# EAGLE schematic rev4.0 (EAGLE 7.5.0)

## Sheet 1 of 3
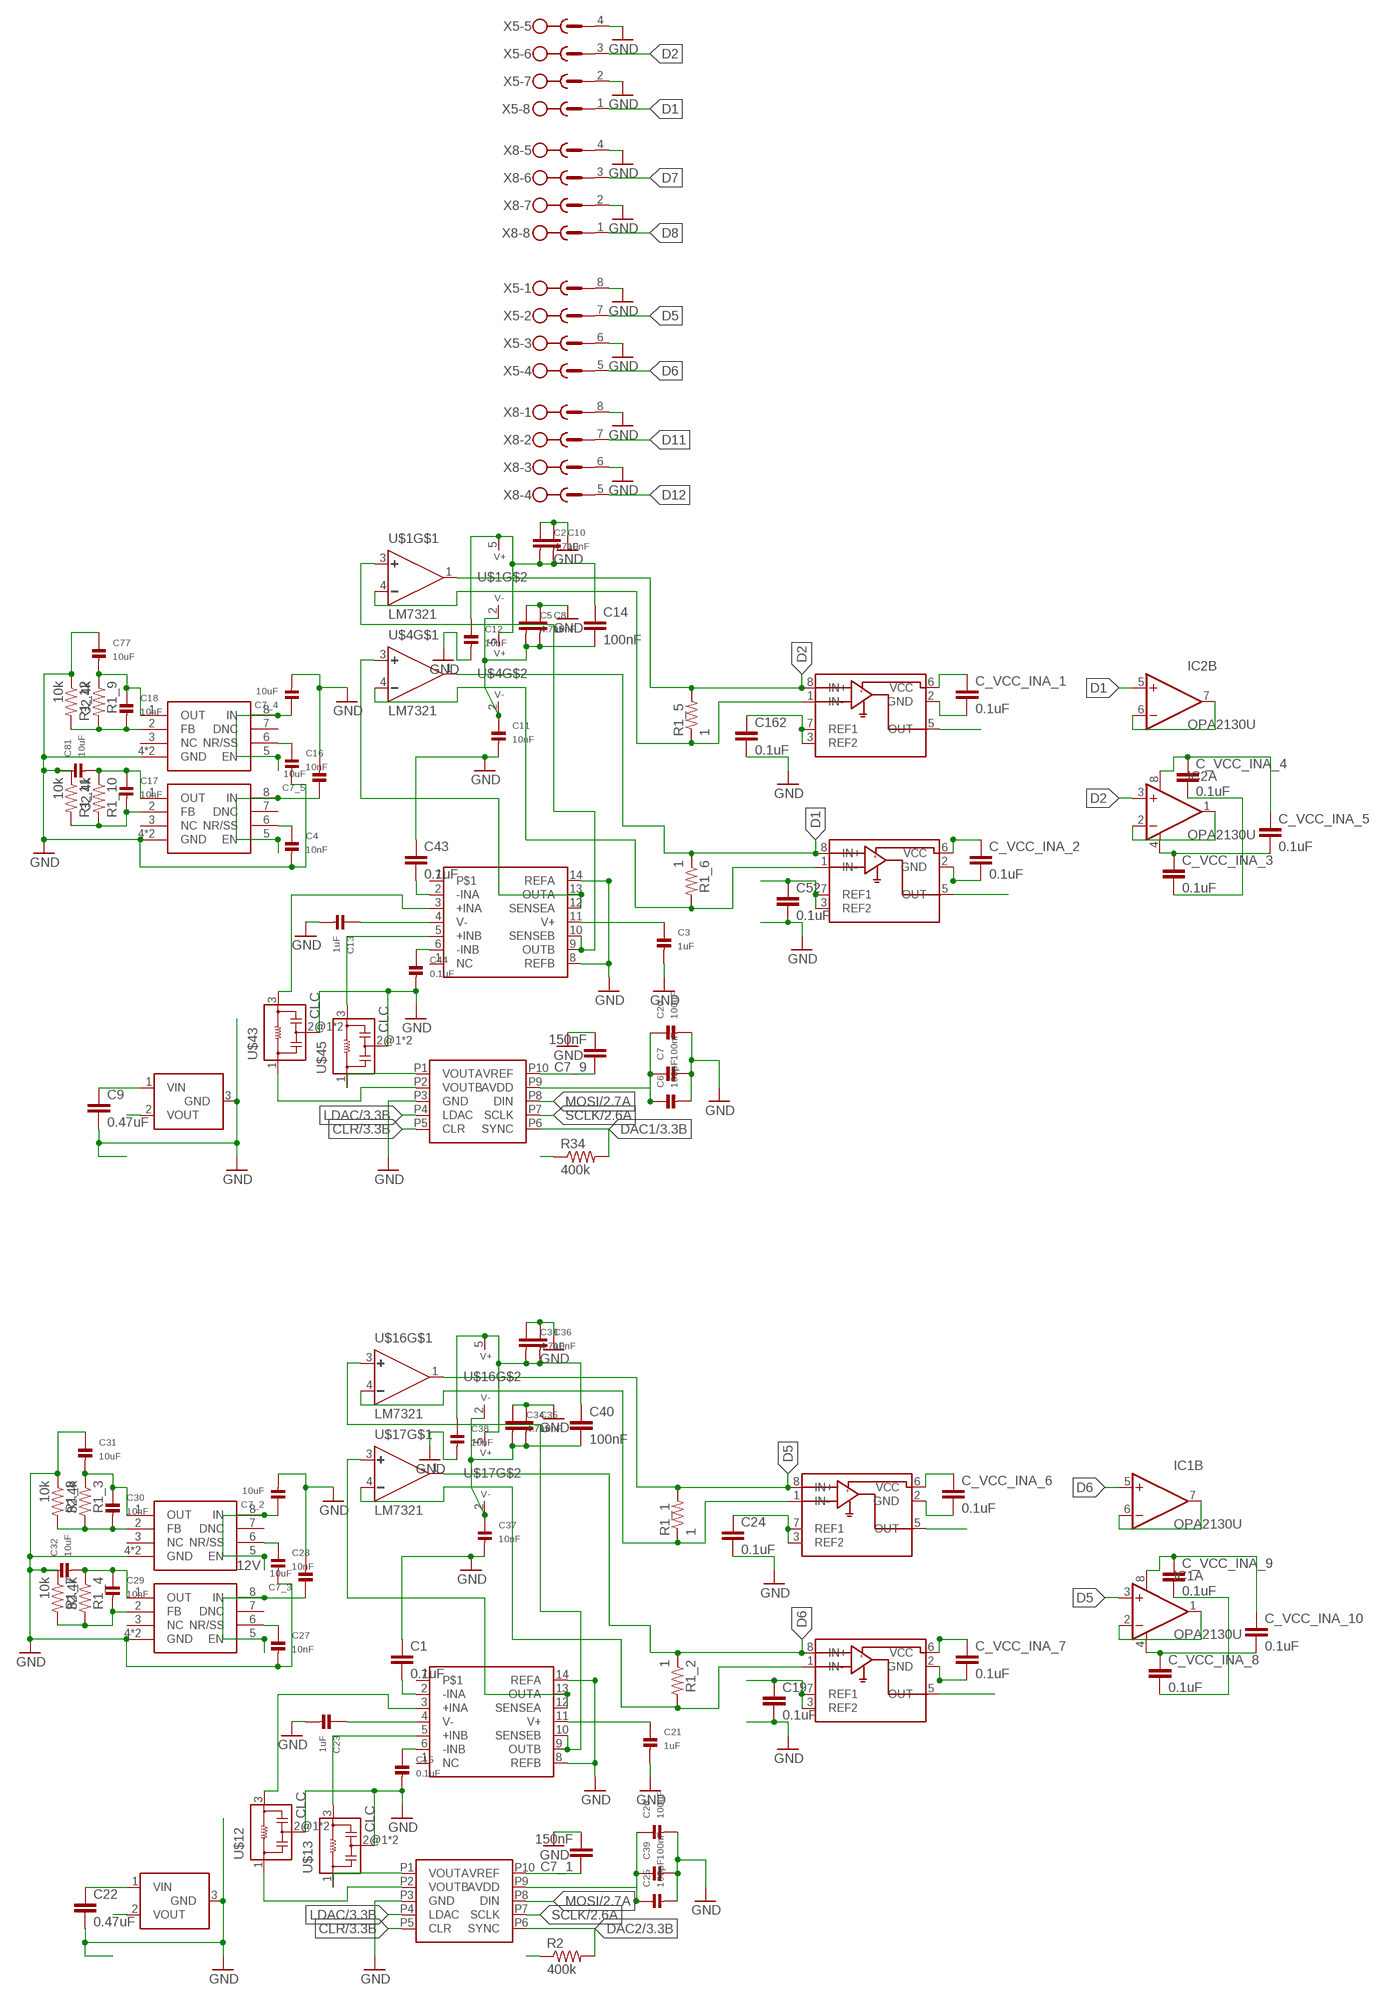
[diagram p0: schematic, sheet 1, part 1 of 2]
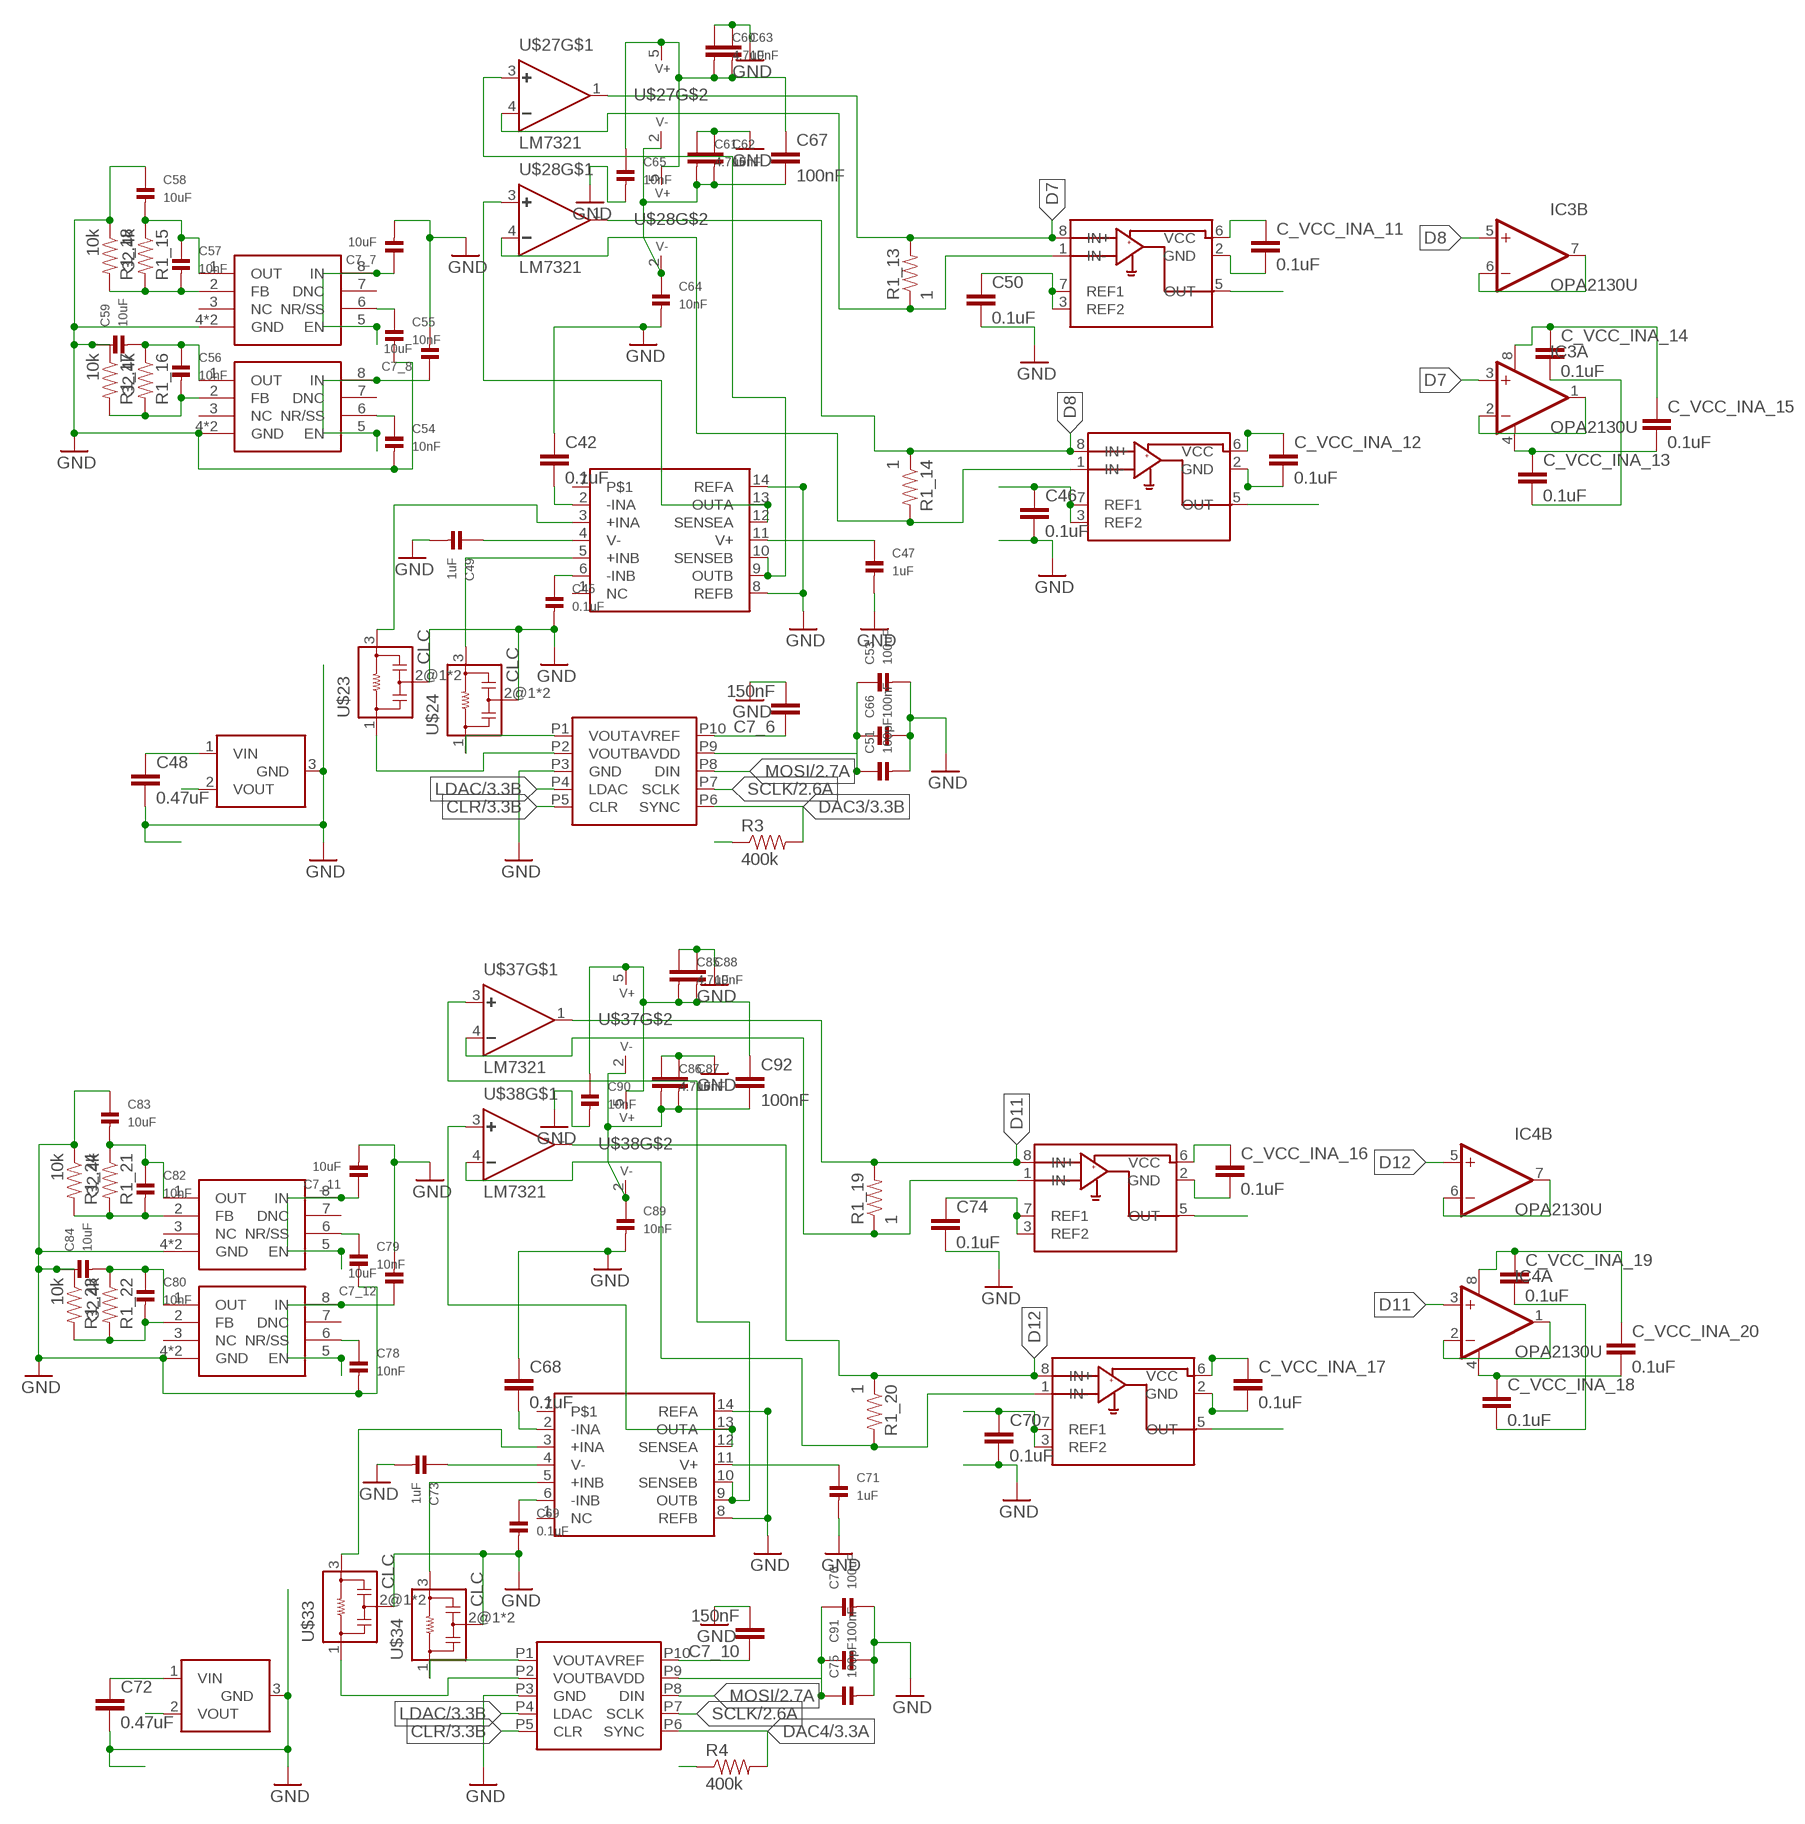
[diagram p1: schematic, sheet 1, part 2 of 2]

### Parts
C1  0.1uF  CAP0402-CAP  [0402-CAP]
C2  4.7uF  CAP_CERAMIC0805  [0805]
C3  1uF  CAP_CERAMIC0402  [0402]
C4  10nF  CAP_CERAMIC0402  [0402]
C5  4.7uF  CAP_CERAMIC0805  [0805]
C6  100pF  CAP_CERAMIC0402  [0402]
C7  100nF  CAP_CERAMIC0402  [0402]
C7_1  150nF  CAP0402-CAP  [0402-CAP]
C7_2  10uF  CAP_CERAMIC0805  [0805]
C7_3  10uF  CAP_CERAMIC0805  [0805]
C7_4  10uF  CAP_CERAMIC0805  [0805]
C7_5  10uF  CAP_CERAMIC0805  [0805]
C7_6  150nF  CAP0402-CAP  [0402-CAP]
C7_7  10uF  CAP_CERAMIC0805  [0805]
C7_8  10uF  CAP_CERAMIC0805  [0805]
C7_9  150nF  CAP0402-CAP  [0402-CAP]
C7_10  150nF  CAP0402-CAP  [0402-CAP]
C7_11  10uF  CAP_CERAMIC0805  [0805]
C7_12  10uF  CAP_CERAMIC0805  [0805]
C8  10nF  CAP_CERAMIC0402  [0402]
C9  0.47uF  CAP0402-CAP  [0402-CAP]
C10  10nF  CAP_CERAMIC0402  [0402]
C11  10nF  CAP_CERAMIC0402  [0402]
C12  10nF  CAP_CERAMIC0402  [0402]
C13  1uF  CAP_CERAMIC0402  [0402]
C14  100nF  CAP0402-CAP  [0402-CAP]
C15  0.1uF  CAP_CERAMIC0402  [0402]
C16  10nF  CAP_CERAMIC0402  [0402]
C17  10nF  CAP_CERAMIC0402  [0402]
C18  10nF  CAP_CERAMIC0402  [0402]
C19  0.1uF  CAP0402-CAP  [0402-CAP]
C20  100uF  CAP_CERAMIC1206  [1206]
C21  1uF  CAP_CERAMIC0402  [0402]
C22  0.47uF  CAP0402-CAP  [0402-CAP]
C23  1uF  CAP_CERAMIC0402  [0402]
C24  0.1uF  CAP0402-CAP  [0402-CAP]
C25  100pF  CAP_CERAMIC0402  [0402]
C26  100uF  CAP_CERAMIC1206  [1206]
C27  10nF  CAP_CERAMIC0402  [0402]
C28  10nF  CAP_CERAMIC0402  [0402]
C29  10nF  CAP_CERAMIC0402  [0402]
C30  10nF  CAP_CERAMIC0402  [0402]
C31  10uF  CAP_CERAMIC0805  [0805]
C32  10uF  CAP_CERAMIC0805  [0805]
C33  4.7uF  CAP_CERAMIC0805  [0805]
C34  4.7uF  CAP_CERAMIC0805  [0805]
C35  10nF  CAP_CERAMIC0402  [0402]
C36  10nF  CAP_CERAMIC0402  [0402]
C37  10nF  CAP_CERAMIC0402  [0402]
C38  10nF  CAP_CERAMIC0402  [0402]
C39  100nF  CAP_CERAMIC0402  [0402]
C40  100nF  CAP0402-CAP  [0402-CAP]
C42  0.1uF  CAP0402-CAP  [0402-CAP]
C43  0.1uF  CAP0402-CAP  [0402-CAP]
C44  0.1uF  CAP_CERAMIC0402  [0402]
C45  0.1uF  CAP_CERAMIC0402  [0402]
C46  0.1uF  CAP0402-CAP  [0402-CAP]
C47  1uF  CAP_CERAMIC0402  [0402]
C48  0.47uF  CAP0402-CAP  [0402-CAP]
C49  1uF  CAP_CERAMIC0402  [0402]
C50  0.1uF  CAP0402-CAP  [0402-CAP]
C51  100pF  CAP_CERAMIC0402  [0402]
C52  0.1uF  CAP0402-CAP  [0402-CAP]
C53  100uF  CAP_CERAMIC1206  [1206]
C54  10nF  CAP_CERAMIC0402  [0402]
C55  10nF  CAP_CERAMIC0402  [0402]
C56  10nF  CAP_CERAMIC0402  [0402]
C57  10nF  CAP_CERAMIC0402  [0402]
C58  10uF  CAP_CERAMIC0805  [0805]
C59  10uF  CAP_CERAMIC0805  [0805]
C60  4.7uF  CAP_CERAMIC0805  [0805]
C61  4.7uF  CAP_CERAMIC0805  [0805]
C62  10nF  CAP_CERAMIC0402  [0402]
C63  10nF  CAP_CERAMIC0402  [0402]
C64  10nF  CAP_CERAMIC0402  [0402]
C65  10nF  CAP_CERAMIC0402  [0402]
C66  100nF  CAP_CERAMIC0402  [0402]
C67  100nF  CAP0402-CAP  [0402-CAP]
C68  0.1uF  CAP0402-CAP  [0402-CAP]
C69  0.1uF  CAP_CERAMIC0402  [0402]
C70  0.1uF  CAP0402-CAP  [0402-CAP]
C71  1uF  CAP_CERAMIC0402  [0402]
C72  0.47uF  CAP0402-CAP  [0402-CAP]
C73  1uF  CAP_CERAMIC0402  [0402]
C74  0.1uF  CAP0402-CAP  [0402-CAP]
C75  100pF  CAP_CERAMIC0402  [0402]
C76  100uF  CAP_CERAMIC1206  [1206]
C77  10uF  CAP_CERAMIC0805  [0805]
C78  10nF  CAP_CERAMIC0402  [0402]
C79  10nF  CAP_CERAMIC0402  [0402]
C80  10nF  CAP_CERAMIC0402  [0402]
C81  10uF  CAP_CERAMIC0805  [0805]
C82  10nF  CAP_CERAMIC0402  [0402]
C83  10uF  CAP_CERAMIC0805  [0805]
C84  10uF  CAP_CERAMIC0805  [0805]
C85  4.7uF  CAP_CERAMIC0805  [0805]
C86  4.7uF  CAP_CERAMIC0805  [0805]
C87  10nF  CAP_CERAMIC0402  [0402]
C88  10nF  CAP_CERAMIC0402  [0402]
C89  10nF  CAP_CERAMIC0402  [0402]
C90  10nF  CAP_CERAMIC0402  [0402]
C91  100nF  CAP_CERAMIC0402  [0402]
C92  100nF  CAP0402-CAP  [0402-CAP]
C162  0.1uF  CAP0402-CAP  [0402-CAP]
C_VCC_INA_1  0.1uF  CAP0402-CAP  [0402-CAP]
C_VCC_INA_2  0.1uF  CAP0402-CAP  [0402-CAP]
C_VCC_INA_3  0.1uF  CAP0402-CAP  [0402-CAP]
C_VCC_INA_4  0.1uF  CAP0402-CAP  [0402-CAP]
C_VCC_INA_5  0.1uF  CAP0402-CAP  [0402-CAP]
C_VCC_INA_6  0.1uF  CAP0402-CAP  [0402-CAP]
C_VCC_INA_7  0.1uF  CAP0402-CAP  [0402-CAP]
C_VCC_INA_8  0.1uF  CAP0402-CAP  [0402-CAP]
C_VCC_INA_9  0.1uF  CAP0402-CAP  [0402-CAP]
C_VCC_INA_10  0.1uF  CAP0402-CAP  [0402-CAP]
C_VCC_INA_11  0.1uF  CAP0402-CAP  [0402-CAP]
C_VCC_INA_12  0.1uF  CAP0402-CAP  [0402-CAP]
C_VCC_INA_13  0.1uF  CAP0402-CAP  [0402-CAP]
C_VCC_INA_14  0.1uF  CAP0402-CAP  [0402-CAP]
C_VCC_INA_15  0.1uF  CAP0402-CAP  [0402-CAP]
C_VCC_INA_16  0.1uF  CAP0402-CAP  [0402-CAP]
C_VCC_INA_17  0.1uF  CAP0402-CAP  [0402-CAP]
C_VCC_INA_18  0.1uF  CAP0402-CAP  [0402-CAP]
C_VCC_INA_19  0.1uF  CAP0402-CAP  [0402-CAP]
C_VCC_INA_20  0.1uF  CAP0402-CAP  [0402-CAP]
IC1  OPA2130U  [SO08]
IC2  OPA2130U  [SO08]
IC3  OPA2130U  [SO08]
IC4  OPA2130U  [SO08]
R1_1  1  RESISTOR0603-RES  [0603-RES]
R1_2  1  RESISTOR0603-RES  [0603-RES]
R1_3  32.4k  RESISTOR0603-RES  [0603-RES]
R1_4  32.4k  RESISTOR0603-RES  [0603-RES]
R1_5  1  RESISTOR0603-RES  [0603-RES]
R1_6  1  RESISTOR0603-RES  [0603-RES]
R1_7  10k  RESISTOR0603-RES  [0603-RES]
R1_8  10k  RESISTOR0603-RES  [0603-RES]
R1_9  32.4k  RESISTOR0603-RES  [0603-RES]
R1_10  32.4k  RESISTOR0603-RES  [0603-RES]
R1_11  10k  RESISTOR0603-RES  [0603-RES]
R1_12  10k  RESISTOR0603-RES  [0603-RES]
R1_13  1  RESISTOR0603-RES  [0603-RES]
R1_14  1  RESISTOR0603-RES  [0603-RES]
R1_15  32.4k  RESISTOR0603-RES  [0603-RES]
R1_16  32.4k  RESISTOR0603-RES  [0603-RES]
R1_17  10k  RESISTOR0603-RES  [0603-RES]
R1_18  10k  RESISTOR0603-RES  [0603-RES]
R1_19  1  RESISTOR0603-RES  [0603-RES]
R1_20  1  RESISTOR0603-RES  [0603-RES]
R1_21  32.4k  RESISTOR0603-RES  [0603-RES]
R1_22  32.4k  RESISTOR0603-RES  [0603-RES]
R1_23  10k  RESISTOR0603-RES  [0603-RES]
R1_24  10k  RESISTOR0603-RES  [0603-RES]
R2  400k  0.27OHM-1/10W-1%(0603)  [0603-RES]
R3  400k  0.27OHM-1/10W-1%(0603)  [0603-RES]
R4  400k  0.27OHM-1/10W-1%(0603)  [0603-RES]
R34  400k  0.27OHM-1/10W-1%(0603)  [0603-RES]
REF1  REF3040  REF3020  [DBZ_R-PDSO-G3]
REF2  REF3040  REF3020  [DBZ_R-PDSO-G3]
REF3  REF3040  REF3020  [DBZ_R-PDSO-G3]
REF3040  REF3040  REF3020  [DBZ_R-PDSO-G3]
U$1  LM7321  [DCK_R-PDSO-G5]
U$2  INA2132  INA2132REALONE  [SO-14]
U$3  DAC7563  [S-PDSO-G10]
U$4  LM7321  [DCK_R-PDSO-G5]
U$5  INA285PDSO-G8  [S-PDSO-G08-NOTHERMALPAD]
U$7  INA285PDSO-G8  [S-PDSO-G08-NOTHERMALPAD]
U$8  INA285PDSO-G8  [S-PDSO-G08-NOTHERMALPAD]
U$9  INA285PDSO-G8  [S-PDSO-G08-NOTHERMALPAD]
U$10  INA2132  INA2132REALONE  [SO-14]
U$11  DAC7563  [S-PDSO-G10]
U$12  CLC  [NFM21C]
U$13  CLC  [NFM21C]
U$14  TPS7A30  [S-PDSO-G08]
U$15  TPS7A30  [S-PDSO-G08]
U$16  LM7321  [DCK_R-PDSO-G5]
U$17  LM7321  [DCK_R-PDSO-G5]
U$18  INA285PDSO-G8  [S-PDSO-G08-NOTHERMALPAD]
U$19  INA285PDSO-G8  [S-PDSO-G08-NOTHERMALPAD]
U$20  INA2132  INA2132REALONE  [SO-14]
U$21  DAC7563  [S-PDSO-G10]
U$23  CLC  [NFM21C]
U$24  CLC  [NFM21C]
U$25  TPS7A30  [S-PDSO-G08]
U$26  TPS7A30  [S-PDSO-G08]
U$27  LM7321  [DCK_R-PDSO-G5]
U$28  LM7321  [DCK_R-PDSO-G5]
U$29  INA285PDSO-G8  [S-PDSO-G08-NOTHERMALPAD]
U$30  INA285PDSO-G8  [S-PDSO-G08-NOTHERMALPAD]
U$31  INA2132  INA2132REALONE  [SO-14]
U$32  DAC7563  [S-PDSO-G10]
U$33  CLC  [NFM21C]
U$34  CLC  [NFM21C]
U$35  TPS7A30  [S-PDSO-G08]
U$36  TPS7A30  [S-PDSO-G08]
U$37  LM7321  [DCK_R-PDSO-G5]
U$38  LM7321  [DCK_R-PDSO-G5]
U$43  CLC  [NFM21C]
U$45  CLC  [NFM21C]
U$53  TPS7A30  [S-PDSO-G08]
U$54  TPS7A30  [S-PDSO-G08]
X5  MSTBV8  [MSTBV8]
X8  MSTBV8  [MSTBV8]

### Nets
12V: C7_2.1 C7_4.1 C7_7.1 C7_11.1 U$14.5(EN) U$14.8(IN) U$25.5(EN) U$25.8(IN) U$35.5(EN) U$35.8(IN) U$53.5(EN) U$53.8(IN) ; also sheet 2,3
-9V: C7_3.1 C7_5.1 C7_8.1 C7_12.1 U$15.5(EN) U$15.8(IN) U$26.5(EN) U$26.8(IN) U$36.5(EN) U$36.8(IN) U$54.5(EN) U$54.8(IN) ; also sheet 2,3
CLR: U$3.P5(CLR) U$11.P5(CLR) U$21.P5(CLR) U$32.P5(CLR) ; also sheet 3
D1: IC2.5(B:+IN) R1_6.1 U$4.1(OUT) U$8.8(IN+) X5.1
D2: IC2.3(A:+IN) R1_5.2 U$1.1(OUT) U$7.8(IN+) X5.3
D5: IC1.3(A:+IN) R1_1.2 U$5.8(IN+) U$16.1(OUT) X5.7
D6: IC1.5(B:+IN) R1_2.1 U$9.8(IN+) U$17.1(OUT) X5.5
D7: IC3.3(A:+IN) R1_13.2 U$18.8(IN+) U$27.1(OUT) X8.3
D8: IC3.5(B:+IN) R1_14.1 U$19.8(IN+) U$28.1(OUT) X8.1
D11: IC4.3(A:+IN) R1_19.2 U$29.8(IN+) U$37.1(OUT) X8.7
D12: IC4.5(B:+IN) R1_20.1 U$30.8(IN+) U$38.1(OUT) X8.5
DAC1: R34.2 U$3.P6(SYNC) ; also sheet 3
DAC2: R2.2 U$11.P6(SYNC) ; also sheet 3
DAC3: R3.2 U$21.P6(SYNC) ; also sheet 3
DAC4: R4.2 U$32.P6(SYNC) ; also sheet 3
GND: C1.1 C2.1 C3.2 C4.2 C5.1 C6.2 C7.2 C7_1.2 C7_2.2 C7_3.2 C7_4.2 C7_5.2 C7_6.2 C7_7.2 C7_8.2 C7_9.2 C7_10.2 C7_11.2 C7_12.2 C8.1 C9.2 C10.1 C11.2 C12.2 C13.2 C15.2 C16.2 C19.2 C20.2 C21.2 C22.2 C23.2 C24.2 C25.2 C26.2 C27.2 C28.2 C31.1 C32.1 C33.1 C34.1 C35.1 C36.1 C37.2 C38.2 C39.2 C42.1 C43.1 C44.2 C45.2 C46.2 C47.2 C48.2 C49.2 C50.2 C51.2 C52.2 C53.2 C54.2 C55.2 C58.1 C59.1 C60.1 C61.1 C62.1 C63.1 C64.2 C65.2 C66.2 C68.1 C69.2 C70.2 C71.2 C72.2 C73.2 C74.2 C75.2 C76.2 C77.1 C78.2 C79.2 C81.1 C83.1 C84.1 C85.1 C86.1 C87.1 C88.1 C89.2 C90.2 C91.2 C162.2 C_VCC_INA_1.2 C_VCC_INA_2.2 C_VCC_INA_3.2 C_VCC_INA_4.2 C_VCC_INA_6.2 C_VCC_INA_7.2 C_VCC_INA_8.2 C_VCC_INA_9.2 C_VCC_INA_11.2 C_VCC_INA_12.2 C_VCC_INA_13.2 C_VCC_INA_14.2 C_VCC_INA_16.2 C_VCC_INA_17.2 C_VCC_INA_18.2 C_VCC_INA_19.2 R1_7.1 R1_8.1 R1_11.1 R1_12.1 R1_17.1 R1_18.1 R1_23.1 R1_24.1 REF1.3(GND) REF2.3(GND) REF3.3(GND) REF3040.3(GND) U$2.8(REFB) U$2.14(REFA) U$3.P3(GND) U$5.2(GND) U$7.2(GND) U$8.2(GND) U$9.2(GND) U$10.8(REFB) U$10.14(REFA) U$11.P3(GND) U$12.2@1 U$12.2@2 U$13.2@1 U$13.2@2 U$14.4(GND) U$14.TH(GND) U$15.4(GND) U$15.TH(GND) U$18.2(GND) U$19.2(GND) U$20.8(REFB) U$20.14(REFA) U$21.P3(GND) U$23.2@1 U$23.2@2 U$24.2@1 U$24.2@2 U$25.4(GND) U$25.TH(GND) U$26.4(GND) U$26.TH(GND) U$29.2(GND) U$30.2(GND) U$31.8(REFB) U$31.14(REFA) U$32.P3(GND) U$33.2@1 U$33.2@2 U$34.2@1 U$34.2@2 U$35.4(GND) U$35.TH(GND) U$36.4(GND) U$36.TH(GND) U$43.2@1 U$43.2@2 U$45.2@1 U$45.2@2 U$53.4(GND) U$53.TH(GND) U$54.4(GND) U$54.TH(GND) X5.2 X5.4 X5.6 X5.8 X8.2 X8.4 X8.6 X8.8 ; also sheet 2,3
LDAC: U$3.P4(LDAC) U$11.P4(LDAC) U$21.P4(LDAC) U$32.P4(LDAC) ; also sheet 3
MOSI: U$3.P8(DIN) U$11.P8(DIN) U$21.P8(DIN) U$32.P8(DIN) ; also sheet 2,3
MUX1: IC2.6(B:-IN) IC2.7(B:OUT) ; also sheet 2
MUX2: IC2.1(A:OUT) IC2.2(A:-IN) ; also sheet 2
MUX3: IC1.6(B:-IN) IC1.7(B:OUT) ; also sheet 2
MUX4: IC1.1(A:OUT) IC1.2(A:-IN) ; also sheet 2
MUX5: IC3.6(B:-IN) IC3.7(B:OUT) ; also sheet 2
MUX6: IC3.1(A:OUT) IC3.2(A:-IN) ; also sheet 2
MUX7: IC4.6(B:-IN) IC4.7(B:OUT) ; also sheet 2
MUX8: IC4.1(A:OUT) IC4.2(A:-IN) ; also sheet 2
MUX9: U$7.5(OUT) ; also sheet 2
MUX10: U$8.5(OUT) ; also sheet 2
MUX11: U$5.5(OUT) ; also sheet 2
MUX12: U$9.5(OUT) ; also sheet 2
MUX13: U$18.5(OUT) ; also sheet 2
MUX14: U$19.5(OUT) ; also sheet 2
MUX15: U$29.5(OUT) ; also sheet 2
MUX16: U$30.5(OUT) ; also sheet 2
N$1: U$3.P1(VOUTA) U$45.1
N$3: U$1.3(+) U$2.9(OUTB) U$2.10(SENSEB)
N$5: U$3.P2(VOUTB) U$43.1
N$7: U$2.12(SENSEA) U$2.13(OUTA) U$4.3(+)
N$10: U$10.9(OUTB) U$10.10(SENSEB) U$16.3(+)
N$13: U$10.12(SENSEA) U$10.13(OUTA) U$17.3(+)
N$14: U$10.5(+INB) U$13.3
N$15: C27.1 U$15.6(NR/SS)
N$16: C28.1 U$14.6(NR/SS)
N$18: C29.2 R1_4.2 R1_7.2 U$15.2(FB)
N$19: C30.2 R1_3.2 R1_8.2 U$14.2(FB)
N$21: U$11.P1(VOUTA) U$13.1
N$22: U$11.P2(VOUTB) U$12.1
N$26: U$20.9(OUTB) U$20.10(SENSEB) U$27.3(+)
N$27: U$20.12(SENSEA) U$20.13(OUTA) U$28.3(+)
N$28: U$20.5(+INB) U$24.3
N$29: C54.1 U$26.6(NR/SS)
N$31: C55.1 U$25.6(NR/SS)
N$32: C56.2 R1_16.2 R1_17.2 U$26.2(FB)
N$33: C57.2 R1_15.2 R1_18.2 U$25.2(FB)
N$35: U$21.P1(VOUTA) U$24.1
N$36: U$21.P2(VOUTB) U$23.1
N$38: U$31.9(OUTB) U$31.10(SENSEB) U$37.3(+)
N$39: U$31.12(SENSEA) U$31.13(OUTA) U$38.3(+)
N$40: U$31.5(+INB) U$34.3
N$41: C78.1 U$36.6(NR/SS)
N$42: C79.1 U$35.6(NR/SS)
N$43: C80.2 R1_22.2 R1_23.2 U$36.2(FB)
N$44: C82.2 R1_21.2 R1_24.2 U$35.2(FB)
N$45: U$32.P1(VOUTA) U$34.1
N$46: U$32.P2(VOUTB) U$33.1
N$103: U$2.5(+INB) U$45.3
N$108: C4.1 U$54.6(NR/SS)
N$109: C16.1 U$53.6(NR/SS)
N$113: C17.2 R1_10.2 R1_11.2 U$54.2(FB)
N$114: C18.2 R1_9.2 R1_12.2 U$53.2(FB)
OUTPUTA: R1_6.2 U$4.4(-) U$8.1(IN-)
OUTPUTA1: R1_2.2 U$9.1(IN-) U$17.4(-)
OUTPUTA2: R1_14.2 U$19.1(IN-) U$28.4(-)
OUTPUTA3: R1_20.2 U$30.1(IN-) U$38.4(-)
OUTPUTB: R1_5.1 U$1.4(-) U$7.1(IN-)
OUTPUTB1: R1_1.1 U$5.1(IN-) U$16.4(-)
OUTPUTB2: R1_13.1 U$18.1(IN-) U$27.4(-)
OUTPUTB3: R1_19.1 U$29.1(IN-) U$37.4(-)
REF2: C1.2 C15.1 C19.1 C24.1 C42.2 C43.2 C44.1 C45.1 C46.1 C50.1 C52.1 C68.2 C69.1 C70.1 C74.1 C162.1 U$2.2(-INA) U$2.6(-INB) U$5.3(REF2) U$5.7(REF1) U$7.3(REF2) U$7.7(REF1) U$8.3(REF2) U$8.7(REF1) U$9.3(REF2) U$9.7(REF1) U$10.2(-INA) U$10.6(-INB) U$18.3(REF2) U$18.7(REF1) U$19.3(REF2) U$19.7(REF1) U$20.2(-INA) U$20.6(-INB) U$29.3(REF2) U$29.7(REF1) U$30.3(REF2) U$30.7(REF1) U$31.2(-INA) U$31.6(-INB) ; also sheet 2
REF3: C7_1.1 REF1.2(VOUT) U$11.P10(VREF)
REF4: C7_9.1 REF3040.2(VOUT) U$3.P10(VREF)
REF6: C7_6.1 REF2.2(VOUT) U$21.P10(VREF)
REF8: C7_10.1 REF3.2(VOUT) U$32.P10(VREF)
SCLK: U$3.P7(SCLK) U$11.P7(SCLK) U$21.P7(SCLK) U$32.P7(SCLK) ; also sheet 2,3
VOUTA: U$2.3(+INA) U$43.3
VOUTA1: U$10.3(+INA) U$12.3
VOUTA2: U$20.3(+INA) U$23.3
VOUTA3: U$31.3(+INA) U$33.3
VREF: C2.2 C3.1 C6.1 C7.1 C9.1 C10.2 C12.1 C14.1 C18.1 C20.1 C77.2 C_VCC_INA_1.1 C_VCC_INA_2.1 C_VCC_INA_4.1 C_VCC_INA_5.1 IC2.8(A:V+) R1_9.1 R34.1 REF3040.1(VIN) U$1.5(V+) U$2.11(V+) U$3.P9(AVDD) U$4.5(V+) U$7.6(VCC) U$8.6(VCC) U$53.1(OUT)
VREF1: C21.1 C22.1 C25.1 C26.1 C30.1 C31.2 C33.2 C36.2 C38.1 C39.1 C40.1 C_VCC_INA_6.1 C_VCC_INA_7.1 C_VCC_INA_9.1 C_VCC_INA_10.1 IC1.8(A:V+) R1_3.1 R2.1 REF1.1(VIN) U$5.6(VCC) U$9.6(VCC) U$10.11(V+) U$11.P9(AVDD) U$14.1(OUT) U$16.5(V+) U$17.5(V+)
VREF2: C47.1 C48.1 C51.1 C53.1 C57.1 C58.2 C60.2 C63.2 C65.1 C66.1 C67.1 C_VCC_INA_11.1 C_VCC_INA_12.1 C_VCC_INA_14.1 C_VCC_INA_15.1 IC3.8(A:V+) R1_15.1 R3.1 REF2.1(VIN) U$18.6(VCC) U$19.6(VCC) U$20.11(V+) U$21.P9(AVDD) U$25.1(OUT) U$27.5(V+) U$28.5(V+)
VREF3: C71.1 C72.1 C75.1 C76.1 C82.1 C83.2 C85.2 C88.2 C90.1 C91.1 C92.1 C_VCC_INA_16.1 C_VCC_INA_17.1 C_VCC_INA_19.1 C_VCC_INA_20.1 IC4.8(A:V+) R1_21.1 R4.1 REF3.1(VIN) U$29.6(VCC) U$30.6(VCC) U$31.11(V+) U$32.P9(AVDD) U$35.1(OUT) U$37.5(V+) U$38.5(V+)
VREF-: C5.2 C8.2 C11.1 C13.1 C14.2 C17.1 C81.2 C_VCC_INA_3.1 C_VCC_INA_5.2 IC2.4(A:V-) R1_10.1 U$1.2(V-) U$2.4(V-) U$4.2(V-) U$54.1(OUT)
VREF-1: C23.1 C29.1 C32.2 C34.2 C35.2 C37.1 C40.2 C_VCC_INA_8.1 C_VCC_INA_10.2 IC1.4(A:V-) R1_4.1 U$10.4(V-) U$15.1(OUT) U$16.2(V-) U$17.2(V-)
VREF-2: C49.1 C56.1 C59.2 C61.2 C62.2 C64.1 C67.2 C_VCC_INA_13.1 C_VCC_INA_15.2 IC3.4(A:V-) R1_16.1 U$20.4(V-) U$26.1(OUT) U$27.2(V-) U$28.2(V-)
VREF-3: C73.1 C80.1 C84.2 C86.2 C87.2 C89.1 C92.2 C_VCC_INA_18.1 C_VCC_INA_20.2 IC4.4(A:V-) R1_22.1 U$31.4(V-) U$36.1(OUT) U$37.2(V-) U$38.2(V-)
Unconnected: U$2.1(NC) U$2.7 U$10.1(NC) U$10.7 U$14.3(NC) U$14.7(DNC) U$15.3(NC) U$15.7(DNC) U$20.1(NC) U$20.7 U$25.3(NC) U$25.7(DNC) U$26.3(NC) U$26.7(DNC) U$31.1(NC) U$31.7 U$35.3(NC) U$35.7(DNC) U$36.3(NC) U$36.7(DNC) U$53.3(NC) U$53.7(DNC) U$54.3(NC) U$54.7(DNC)

## Sheet 2 of 3
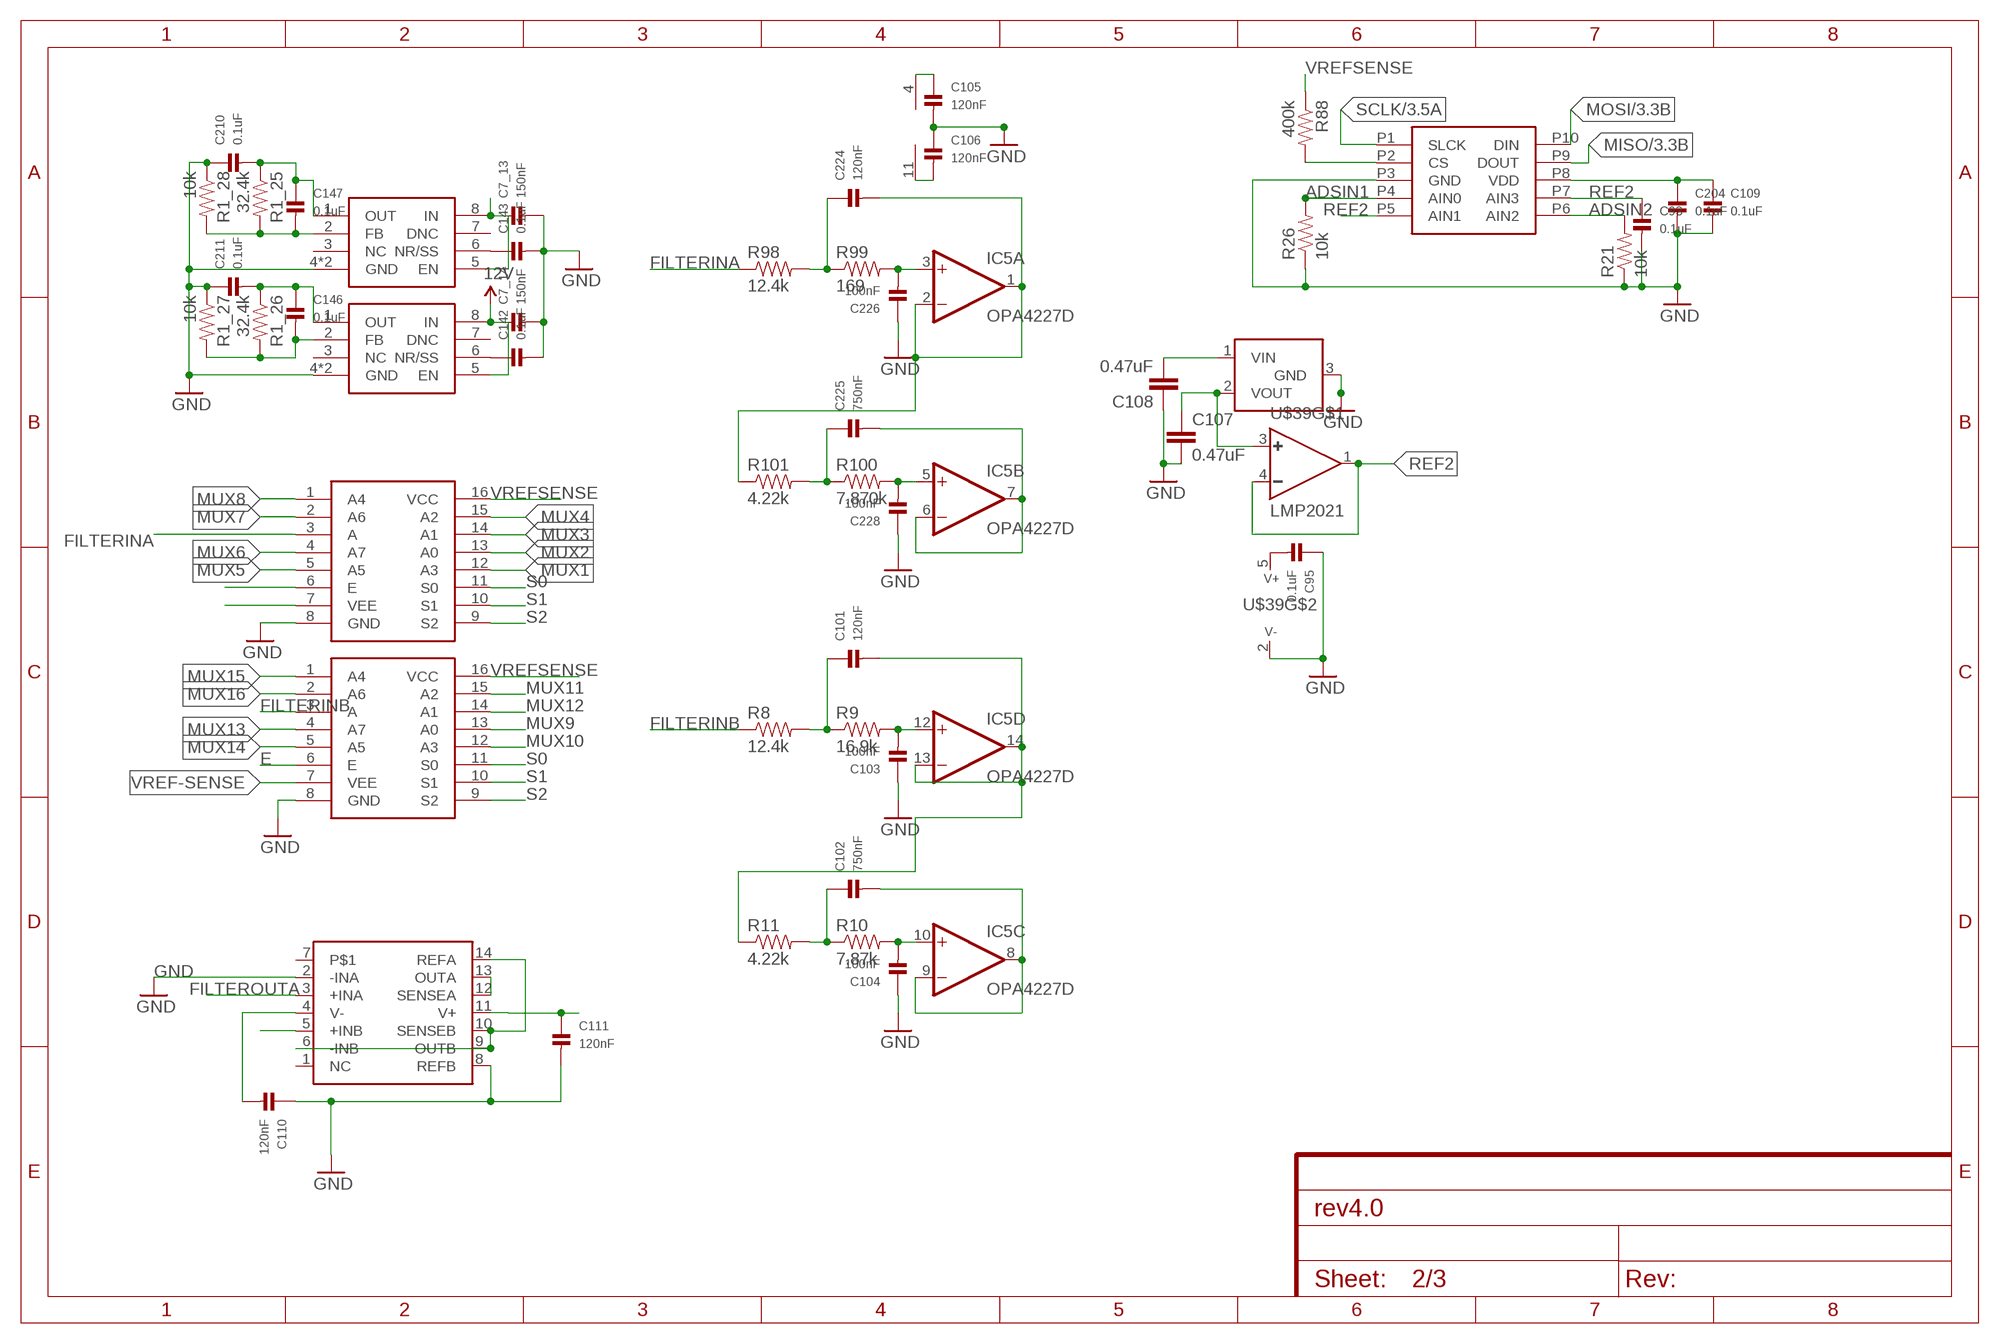
[diagram p2: schematic, sheet 2]
ADLINE (FRAME-A4L): CNAME: A/D; CREVISION: 4.0; DESIGNER: Norman Pellet

### Parts
C7_13  150nF  CAP_CERAMIC0603MINI  [0603-MINI]
C7_14  150nF  CAP_CERAMIC0603MINI  [0603-MINI]
C93  0.1uF  CAP_CERAMIC0402  [0402]
C95  0.1uF  CAP_CERAMIC0402  [0402]
C101  120nF  CAP_CERAMIC0402  [0402]
C102  750nF  CAP_CERAMIC0402  [0402]
C103  100nF  CAP_CERAMIC0402  [0402]
C104  100nF  CAP_CERAMIC0402  [0402]
C105  120nF  CAP_CERAMIC0402  [0402]
C106  120nF  CAP_CERAMIC0402  [0402]
C107  0.47uF  CAP0402-CAP  [0402-CAP]
C108  0.47uF  CAP0402-CAP  [0402-CAP]
C109  0.1uF  CAP_CERAMIC0402  [0402]
C110  120nF  CAP_CERAMIC0402  [0402]
C111  120nF  CAP_CERAMIC0402  [0402]
C142  0.1uF  CAP_CERAMIC0402  [0402]
C143  0.1uF  CAP_CERAMIC0402  [0402]
C146  0.1uF  CAP_CERAMIC0402  [0402]
C147  0.1uF  CAP_CERAMIC0402  [0402]
C204  0.1uF  CAP_CERAMIC0402  [0402]
C210  0.1uF  CAP_CERAMIC0603MINI  [0603-MINI]
C211  0.1uF  CAP_CERAMIC0603MINI  [0603-MINI]
C224  120nF  CAP_CERAMIC0402  [0402]
C225  750nF  CAP_CERAMIC0402  [0402]
C226  100nF  CAP_CERAMIC0402  [0402]
C228  100nF  CAP_CERAMIC0402  [0402]
IC5  OPA4227D  [SO14]
R1_25  32.4k  RESISTOR0603-RES  [0603-RES]
R1_26  32.4k  RESISTOR0603-RES  [0603-RES]
R1_27  10k  RESISTOR0603-RES  [0603-RES]
R1_28  10k  RESISTOR0603-RES  [0603-RES]
R8  12.4k  RESISTOR0603-RES  [0603-RES]
R9  16.9k  RESISTOR0603-RES  [0603-RES]
R10  7.87k  RESISTOR0603-RES  [0603-RES]
R11  4.22k  RESISTOR0603-RES  [0603-RES]
R21  10k  0OHM-1/10W-5%(0603)  [0603]
R26  10k  0OHM-1/10W-5%(0603)  [0603]
R88  400k  0.27OHM-1/10W-1%(0603)  [0603-RES]
R98  12.4k  RESISTOR0603-RES  [0603-RES]
R99  169  RESISTOR0603-RES  [0603-RES]
R100  7.870k  RESISTOR0603-RES  [0603-RES]
R101  4.22k  RESISTOR0603-RES  [0603-RES]
REF7  REF3020  [DBZ_R-PDSO-G3]
U$6  CD54HC4051  [PW_R-PDSO-G16]
U$39  LMP2021  [SOT23-DBV]
U$40  ADS1018  [S-PDSO-G10]
U$48  TPS7A30  [S-PDSO-G08]
U$49  TPS7A30  [S-PDSO-G08]
U$57  CD54HC4051  [PW_R-PDSO-G16]
U$58  INA2132  INA2132REALONE  [SO-14]

### Nets
12V: C7_14.1 U$49.5(EN) U$49.8(IN) ; also sheet 1,3
-9V: C7_13.1 U$48.5(EN) U$48.8(IN) ; also sheet 1,3
ADCCS: R88.2 U$40.P2(CS) ; also sheet 3
ADSIN1: C102.2 IC5.8(C:OUT) IC5.9(C:-IN) R26.2 U$40.P4(AIN0)
ADSIN2: R21.2 U$40.P6(AIN2) U$58.12(SENSEA) U$58.13(OUTA)
E: U$6.6(E) U$57.6(E) ; also sheet 3
FILTERINA: R98.1 U$6.3(A)
FILTERINB: R8.1 U$57.3(A)
FILTEROUTA: C225.2 IC5.6(B:-IN) IC5.7(B:OUT) U$58.3(+INA)
GND: C7_13.2 C7_14.2 C93.2 C95.1 C103.1 C104.1 C105.2 C106.1 C107.2 C108.1 C109.2 C110.1 C111.2 C142.2 C143.2 C204.2 C210.1 C211.1 C226.1 C228.1 R1_27.1 R1_28.1 R21.1 R26.1 REF7.3(GND) U$6.8(GND) U$39.2(V-) U$40.P3(GND) U$48.4(GND) U$48.TH(GND) U$49.4(GND) U$49.TH(GND) U$57.8(GND) U$58.2(-INA) U$58.8(REFB) ; also sheet 1,3
MISO: U$40.P9(DOUT) ; also sheet 3
MOSI: U$40.P10(DIN) ; also sheet 1,3
MUX1: U$6.12(A3) ; also sheet 1
MUX2: U$6.13(A0) ; also sheet 1
MUX3: U$6.14(A1) ; also sheet 1
MUX4: U$6.15(A2) ; also sheet 1
MUX5: U$6.5(A5) ; also sheet 1
MUX6: U$6.4(A7) ; also sheet 1
MUX7: U$6.2(A6) ; also sheet 1
MUX8: U$6.1(A4) ; also sheet 1
MUX9: U$57.13(A0) ; also sheet 1
MUX10: U$57.12(A3) ; also sheet 1
MUX11: U$57.15(A2) ; also sheet 1
MUX12: U$57.14(A1) ; also sheet 1
MUX13: U$57.4(A7) ; also sheet 1
MUX14: U$57.5(A5) ; also sheet 1
MUX15: U$57.1(A4) ; also sheet 1
MUX16: U$57.2(A6) ; also sheet 1
N$17: C107.1 REF7.2(VOUT) U$39.3(+)
N$56: C101.2 IC5.13(D:-IN) IC5.14(D:OUT) R11.1
N$57: C103.2 IC5.12(D:+IN) R9.2
N$58: C104.2 IC5.10(C:+IN) R10.2
N$59: C102.1 R10.1 R11.2
N$61: U$58.6(-INB) U$58.9(OUTB) U$58.10(SENSEB) U$58.14(REFA)
N$62: C101.1 R8.2 R9.1
N$128: C143.1 U$48.6(NR/SS)
N$129: C142.1 U$49.6(NR/SS)
N$130: C146.2 R1_26.2 R1_27.2 U$49.2(FB)
N$131: C147.2 R1_25.2 R1_28.2 U$48.2(FB)
N$134: C226.2 IC5.3(A:+IN) R99.2
N$142: C228.2 IC5.5(B:+IN) R100.2
N$143: C225.1 R100.1 R101.2
N$146: C224.2 IC5.1(A:OUT) IC5.2(A:-IN) R101.1
N$149: C224.1 R98.2 R99.1
REF2: C93.1 U$39.1(OUT) U$39.4(-) U$40.P5(AIN1) U$40.P7(AIN3) U$58.5(+INB) ; also sheet 1
S0: U$6.11(S0) U$57.11(S0) ; also sheet 3
S1: U$6.10(S1) U$57.10(S1) ; also sheet 3
S2: U$6.9(S2) U$57.9(S2) ; also sheet 3
SCLK: U$40.P1(SLCK) ; also sheet 1,3
VREF-SENSE: C106.2 C110.2 C147.1 C210.2 IC5.11(P:V-) R1_25.1 U$6.7(VEE) U$48.1(OUT) U$57.7(VEE) U$58.4(V-)
VREFSENSE: C95.2 C105.1 C108.2 C109.1 C111.1 C146.1 C204.1 C211.2 IC5.4(P:V+) R1_26.1 R88.1 REF7.1(VIN) U$6.16(VCC) U$39.5(V+) U$40.P8(VDD) U$49.1(OUT) U$57.16(VCC) U$58.11(V+)
Unconnected: U$48.3(NC) U$48.7(DNC) U$49.3(NC) U$49.7(DNC) U$58.1(NC) U$58.7

## Sheet 3 of 3
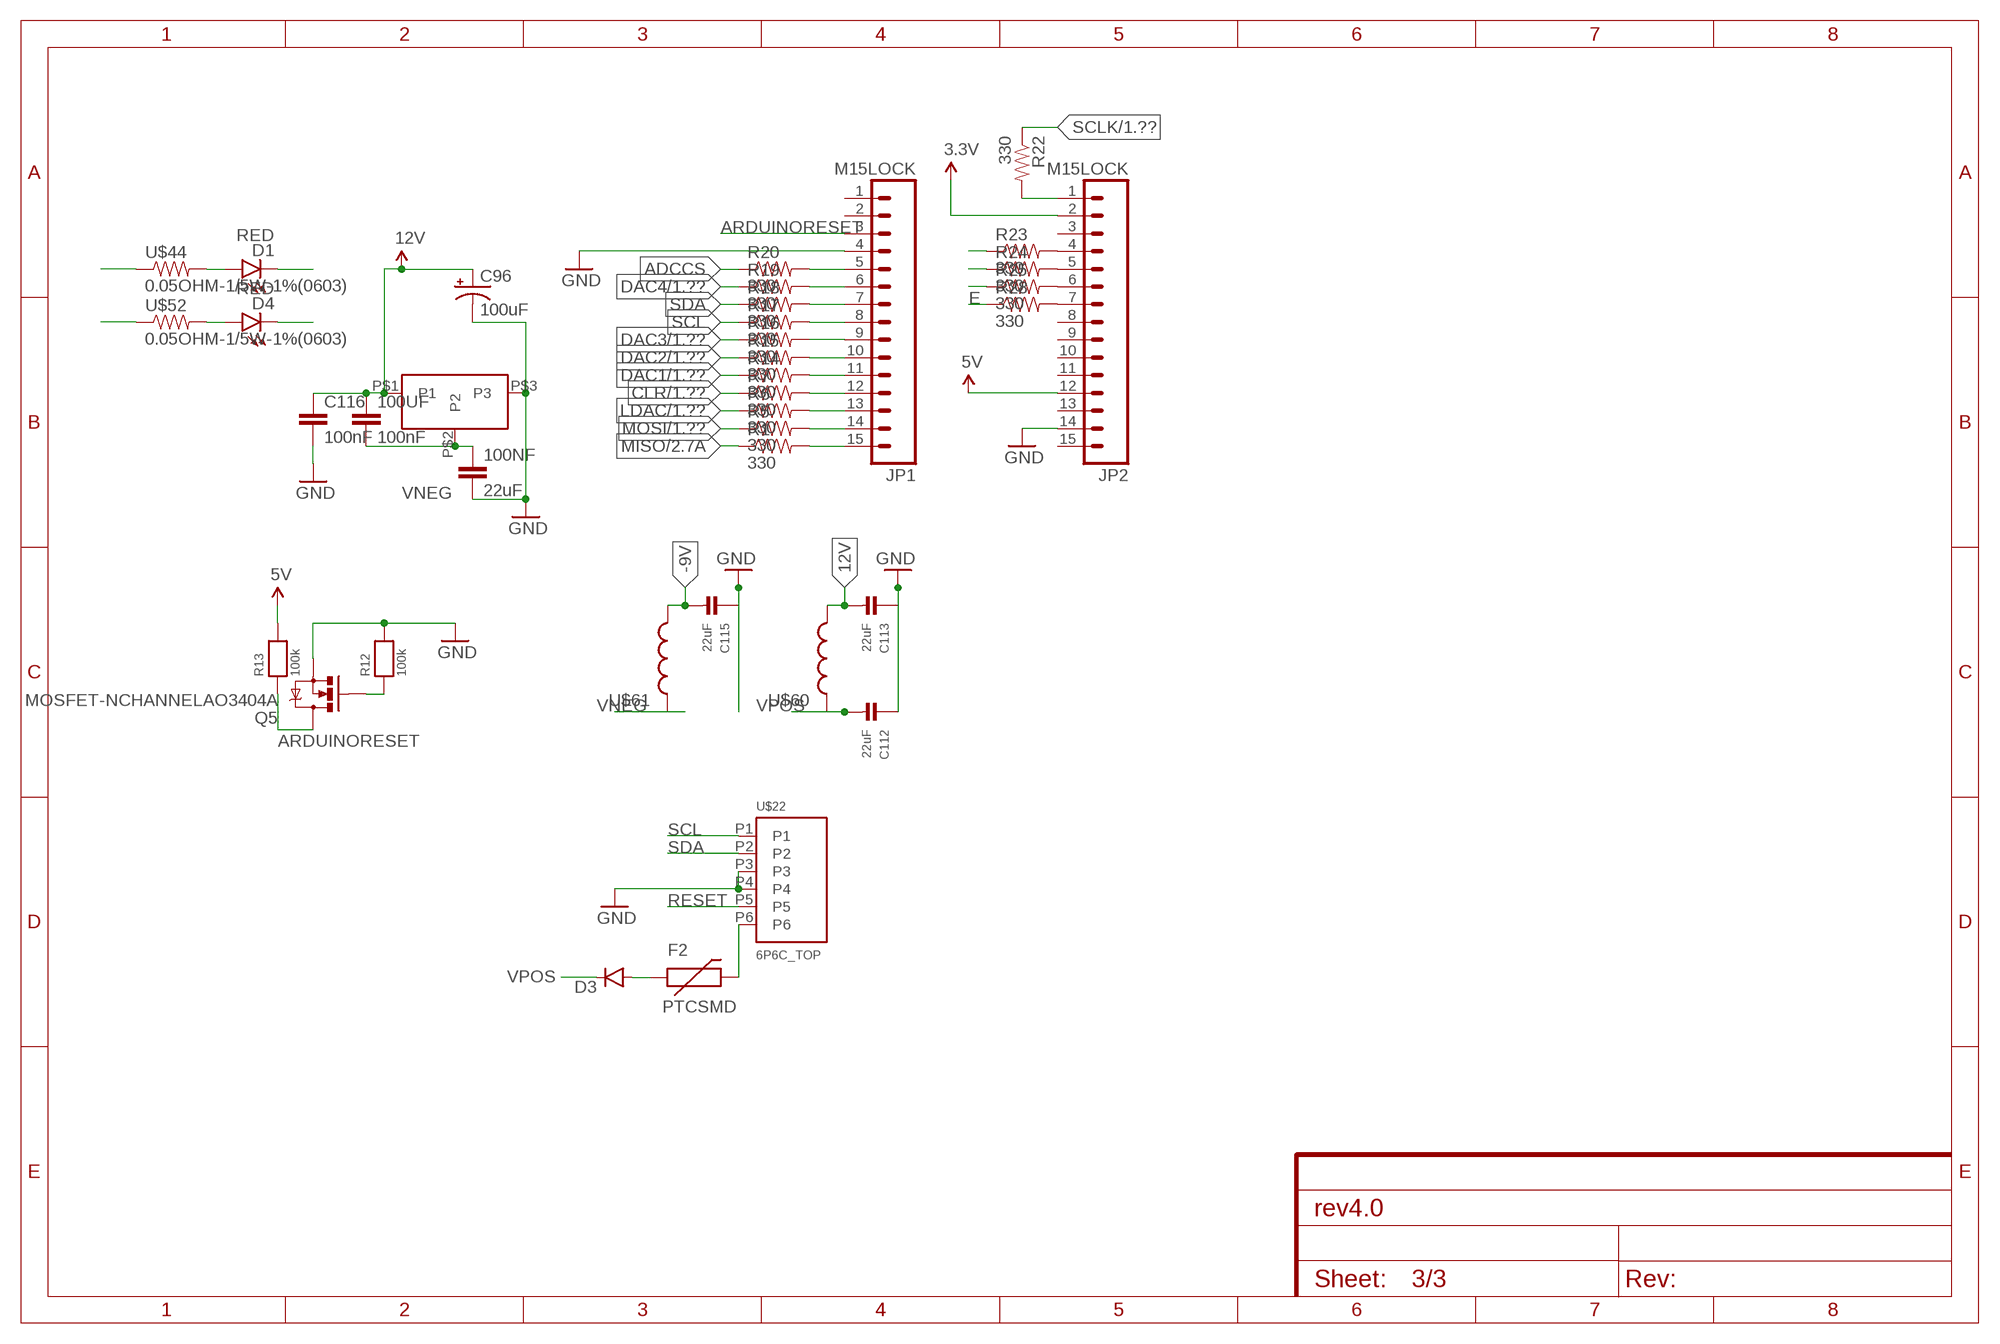
[diagram p3: schematic, sheet 3]

### Parts
100NF  22uF  1.0UF50V10%(1206)  [1206-CAP]
100UF  100nF  1.0UF50V10%(1206)  [1206-CAP]
C96  100uF  CAP_POLF80  [NIPPON_F80]
C112  22uF  CAP_CERAMIC1206  [1206]
C113  22uF  CAP_CERAMIC1206  [1206]
C115  22uF  CAP_CERAMIC1206  [1206]
C116  100nF  1.0UF50V10%(1206)  [1206-CAP]
D1  RED  LED-RED1206  [LED-1206]
D3  DIODESMA  [SMA-DIODE]
D4  RED  LED-RED1206  [LED-1206]
F2  PTCSMD  [PTC-1206]
JP1  M15LOCK  [1X15_LOCK]
JP2  M15LOCK  [1X15_LOCK]
Q5  MOSFET-NCHANNELAO3404A  [SOT23-3]
R1  330  RESISTOR0603-RES  [0603-RES]
R5  330  RESISTOR0603-RES  [0603-RES]
R6  330  RESISTOR0603-RES  [0603-RES]
R7  330  RESISTOR0603-RES  [0603-RES]
R12  100k  RESISTOR0402  [0402]
R13  100k  RESISTOR0402  [0402]
R14  330  RESISTOR0603-RES  [0603-RES]
R15  330  RESISTOR0603-RES  [0603-RES]
R16  330  RESISTOR0603-RES  [0603-RES]
R17  330  RESISTOR0603-RES  [0603-RES]
R18  330  RESISTOR0603-RES  [0603-RES]
R19  330  RESISTOR0603-RES  [0603-RES]
R20  330  RESISTOR0603-RES  [0603-RES]
R22  330  RESISTOR0603-RES  [0603-RES]
R23  330  RESISTOR0603-RES  [0603-RES]
R24  330  RESISTOR0603-RES  [0603-RES]
R25  330  RESISTOR0603-RES  [0603-RES]
R28  330  RESISTOR0603-RES  [0603-RES]
U$22  6P6C_TOP  [6P6C_TOP]
U$42  TSRN1  [TSRN1]
U$44  0.05OHM-1/5W-1%(0603)  [0603]
U$52  0.05OHM-1/5W-1%(0603)  [0603]
U$60  INDUCTOR0603  [0603]
U$61  INDUCTOR0603  [0603]

### Nets
3.3V: JP2.2
5V: JP2.12 R13.2
12V: 100UF.1 C96.+ C113.2 C116.1 U$42.P$1(P1) U$44.1 U$60.2 ; also sheet 1,2
-9V: C115.2 D4.C U$61.2 ; also sheet 1,2
ADCCS: R20.1 ; also sheet 2
ARDUINORESET: JP1.3 Q5.3(D) R13.1
CLR: R7.1 ; also sheet 1
D13: JP1.15 R1.2
D14: JP1.14 R5.2
D15: JP1.13 R6.2
D16: JP1.12 R7.2
D17: JP1.11 R14.2
D18: JP1.10 R15.2
D19: JP1.9 R16.2
D20: JP1.8 R17.2
D21: JP1.7 R18.2
D22: JP1.6 R19.2
D23: JP1.5 R20.2
DAC1: R14.1 ; also sheet 1
DAC2: R15.1 ; also sheet 1
DAC3: R16.1 ; also sheet 1
DAC4: R19.1 ; also sheet 1
E: R28.1 ; also sheet 2
GND: 100NF.2 C96.- C112.1 C113.1 C115.1 C116.2 D1.C JP1.4 JP2.14 Q5.2(S) R12.2 U$22.P3 U$22.P4 U$42.P$3(P3) U$52.1 ; also sheet 1,2
LDAC: R6.1 ; also sheet 1
MISO: R1.1 ; also sheet 2
MOSI: R5.1 ; also sheet 1,2
N$4: JP2.7 R28.2
N$9: JP2.1 R22.2
N$11: JP2.4 R23.2
N$12: D1.A U$44.2
N$20: JP2.5 R24.2
N$23: JP2.6 R25.2
N$63: F2.2 U$22.P6
N$65: D3.A F2.1
N$107: D4.A U$52.2
RESET: Q5.1(G) R12.1 U$22.P5
S0: R23.1 ; also sheet 2
S1: R24.1 ; also sheet 2
S2: R25.1 ; also sheet 2
SCL: R17.1 U$22.P1
SCLK: R22.1 ; also sheet 1,2
SDA: R18.1 U$22.P2
VNEG: 100NF.1 100UF.2 U$42.P$2(P2) U$61.1
VPOS: C112.2 D3.C U$60.1
Unconnected: JP1.1 JP1.2 JP2.3 JP2.8 JP2.9 JP2.10 JP2.11 JP2.13 JP2.15

## Library data of the parts
100NF 100UF C116 = SparkFun-Capacitors:1.0UF50V10%(1206): CAP-09822
C1 C7_1 C7_6 C7_9 C7_10 C9 C14 C19 C22 C24 C40 C42 C43 C46 C48 C50 C52 C67 C68 C70 C72 C74 C92 C107 C108 C162 C_VCC_INA_1-C_VCC_INA_20 = SparkFun:CAP: Capacitor Standard 0603 ceramic capacitor, and 0.1" leaded capacitor.
C2-C7 C7_2-C7_5 C7_7 C7_8 C7_11-C7_14 C8 C10-C13 C15-C18 C20 C21 C23 C25-C39 C44 C45 C47 C49 C51 C53-C66 C69 C71 C73 C75-C91 C93 C95 C101-C106 C109-C113 C115 C142 C143 C146 C147 C204 C210 C211 C224-C226 C228 = microbuilder:CAP_CERAMIC: Ceramic Capacitors 0402 - 0402 Surface Mount Capacitors 16pF 50V 5% [Digikey: 445-4899-2-ND] 18pF 50V 5% [Digikey: 490-1281-2-ND] 22pF 50V 5% [Digikey: 490-1283-2-ND] 68pF 50V 5% [Digikey: 490-1289-2-ND] 0.1uF 10V 10% [Digikey: 490-1318-2-ND] 1.0uF 6.3V 10% [Digikey: 490-1320-2-ND] 0603 - 0603 Surface Mount Capacitors 16 pF 50V 5% [Digikey: 445-5051-2-ND] 22 pF 50V [Digikey: PCC220ACVTR-ND] 33 pF 50V 5% [Digikey: 490-1415-1-ND] 56pF 50V 5% [Digikey: 490-1421-1-ND] 220pF 50V 5% [Digikey: 445-1285-1-ND] 680 pF 50V 2200 pF 50V 5% C0G [Digikey: 445-1297-1-ND] 5600 pF 100V 5% X7R [Digikey: 478-3711-1-ND] 0.1 µF 25V 10% [Digikey: PCC2277TR-ND] 0.22 µF 16V 10% X7R [Digikey: 445-1318-1-ND] 1.0 µF 25V 10% [Digikey: 445-5146-2-ND] 0603 - RF Specific 3pF 250V +/-0.1pF RF [Digikey: 712-1347-1-ND] 18 pF 250V 5% [Digikey: 478-3505-1-ND or 712-1322-1-ND] 56 pF 250V 5% C0G RF [Digikey: 490-4867-1-ND] 68 pF 250V RF [Digikey: 490-4868-1-ND] 0805 - 0805 Surface Mount Capacitors 220 pF 250V 2% RF Ceramic Capacitor [Digikey: 712-1398-1-ND] 1000 pF 50V 2% NP0 Ceramic Capacitor [Digikey: 478-3760-1-ND] 0.1 µF 25V 10% Ceramic Capacitor [Digikey: PCC1828TR-ND] 1.0 µF 16V 10% Ceramic Capacitor[Digikey: 490-1691-2-ND] 10.0 µF 10V 10% Ceramic Capacitor[Digikey: 709-1228-1-ND] 10.0 uF 16V 10% Ceramic Capacitor [Digikey: 478-5165-2-ND] 47 uF 6.3V 20% Ceramic Capacitor [Digikey: 587-1779-1-ND or 399-5506-1-ND] 1206 - 1206 Surface Mount Capacitors 47uF 10V 20% Ceramic Capacitor [Digikey: 490-5528-1-ND or 399-5508-1-ND or 445-6010-1-ND] 100uF 6.3V -20%, +80% Y5V Ceramic Capacitor (Digikey: 490-4512-1-ND, Mouser: 81-GRM31CF50J107ZE1L)
C96 = SparkFun-Capacitors:CAP_POL: Capacitor Polarized These are standard SMD and PTH capacitors. Normally 10uF, 47uF, and 100uF in electrolytic and tantalum varieties. Always verify the external diameter of the through hole cap, it varies with capacity, voltage, and manufacturer. The EIA devices should be standard.
D1 D4 = SparkFun-LED:LED-RED: Assorted Red LEDs LilyPad 1206- DIO-09912 1206- DIO-00809 0603- DIO-00819 "SMART" means more efficient and expensive; PROD_ID: DIO-09912
D3 = SparkFun-DiscreteSemi:DIODE: Diode These are standard reverse protection diodes and small signal diodes. SMA package can handle up to about 1A. SOD-323 can handle about 200mA. What the SOD-323 package when ordering, there are some mfgs out there that are 5-pin packages.
F2 = SparkFun:PTC: Resettable Fuse PTC Resettable Fuse. Spark Fun Electronics SKU : COM-08357
IC1-IC4 = burr-brown:OPA2130: Operational Amplifier; MF: TEXAS INSTRUMENTS; MPN: OPA2130UA; OC_FARNELL: 1459554; OC_NEWARK: 35C1841
IC5 = linear:OPA422*: High Precision, Low Noise OPERATIONAL AMPLIFIERS Source: http://focus.ti.com/lit/ds/symlink/opa227.pdf
JP1 JP2 = SparkFun-Connectors:M15: Header 15 Standard 15-pin 0.1" header. Use with straight break away headers (SKU : PRT-00116), right angle break away headers (PRT-00553), swiss pins (PRT-00743), machine pins (PRT-00117), and female headers (PRT-00115).
Q5 = SparkFun-DiscreteSemi:MOSFET-NCHANNEL: Common NMOSFET Parts MFG P/N Store ID Prod ID FDD8780 TRANS-09984 SI7820DN TRANS-11055 FDS6630A IC-08089 2N7002PW TRANS-11151 FQP30N06L COM-10213 TRANS-10060 BSS123LT1G TRANS-08345 BSS138 TRANS-00830 BS170 2N7000; PROD_ID: TRAN-12988
R1 R1_3 R1_4 R1_7-R1_12 R1_15-R1_18 R1_21-R1_28 R5-R11 R14-R20 R22-R25 R28 R98-R101 = SparkFun-Passives:RESISTOR: Resistor
R1_1 R1_2 R1_5 R1_6 R1_13 R1_14 R1_19 R1_20 = SparkFun:RESISTOR: Resistor
R2-R4 R34 R88 = SparkFun-Resistors:0.27OHM-1/10W-1%(0603): RES-08787
R12 R13 = microbuilder:RESISTOR: Resistors 0402 - 0402 Surface Mount Package 22 Ohm 1% 1/16W [Digikey: 311-22.0LRTR-ND] 33 Ohm 5% 1/16W 1.0K 5% 1/16W 1.5K 5% 1/16W 2.0K 1% 1/16W 10.0K 1% 1/16W [Digikey: 311-10.0KLRTR-ND] 10.0K 5% 1/16W [Digikey: RMCF0402JT10K0TR-ND] 12.1K 1% 1/16W [Digikey: 311-22.0LRTR-ND] 100.0K 5% 1/16W 0603 - 0603 Surface Mount Package 0 Ohm 1/10 Watt 1% Resistor 15 Ohm 1/10 Watt 1% Resistor 33 Ohm 1/10 Watt 1% Resistor 49.9 Ohm 1/10 Watt 1% Resistor 100 Ohm 1/10 Watt 1% Resistor 150 Ohm 1/10 Watt 1% Resistor 240 Ohm 1/10 Watt 1% Resistor 390 Ohm 1/10 Watt 1% Resistor 560 Ohm 1/10 Watt 1% Resistor 680 Ohm 1/10 Watt 1% Resistor 750 Ohm 1/10 Watt 1% Resistor 1.0K Ohm 1/10 Watt 1% Resistor 1.5K Ohm 1/10 Watt 1% Resistor 2.0K Ohm 1/10 Watt 1% Resistor 2.2K Ohm 1/10 Watt 1% Resistor 3.3K Ohm 1/10 Watt 1% Resistor 4.7K Ohm 1/10 Watt 1% Resistor 10.0K Ohm 1/10 Watt 1% Resistor 12.0K Ohm 1/10 Watt 1% Resistor 12.1K Ohm 1/10 Watt 1% Resistor 20.0K Ohm 1/10 Watt 1% Resistor 33.0K Ohm 1/10 Watt 1% Resistor 100.0K Ohm 1/10 Watt 1% Resistor 0805 - 0805 Surface Mount Package 0 Ohm 1/8 Watt 1% Resistor 33 Ohm 1/8 Watt 1% Resistor 100 Ohm 1/8 Watt 1% Resistor 150 Ohm 1/8 Watt 1% Resistor 200 Ohm 1/8 Watt 1% Resistor 240 Ohm 1/8 Watt 1% Resistor 330 Ohm 1/8 Watt 1% Resistor 390 Ohm 1/8 Watt 1% Resistor 470 Ohm 1/8 Watt 1% Resistor 1.0K Ohm 1/8 Watt 1% Resistor 1.5K Ohm 1/8 Watt 1% Resistor 2.0K Ohm 1/8 Watt 1% Resistor 4.7K Ohm 1/8 Watt 1% Resistor 5.1K Ohm 1/8 Watt 1% Resistor 5.6K Ohm 1/8 Watt 1% Resistor 10.0K Ohm 1/8 Watt 1% Resistor 22.0K Ohm 1/8 Watt 1% Resistor 33.0K Ohm 1/8 Watt 1% Resistor 100K Ohm 1/8 Watt 1% Resistor 1206 - 1206 Surface Mount Package 2012 - 2010 Surface Mount Package 0.11 Ohm 1/2 Watt 1% Resistor - Digikey: RHM.11UCT-ND
R21 R26 = SparkFun-Resistors:0OHM-1/10W-5%(0603): RES-08609; PROD_ID: RES-08609; VALUE: 0
REF1-REF3 REF7 REF3040 = texas:REF3020
U$1 U$4 U$16 U$17 U$27 U$28 U$37 U$38 = texas:LM7321
U$2 U$10 U$20 U$31 U$58 = texas:INA2132
U$3 U$11 U$21 U$32 = texas:DAC7563
U$5 U$7-U$9 U$18 U$19 U$29 U$30 = texas:INA285
U$6 U$57 = texas:CD54HC4051
U$12 U$13 U$23 U$24 U$33 U$34 U$43 U$45 = murata-filter:CLC
U$14 U$15 U$25 U$26 U$35 U$36 U$48 U$49 U$53 U$54 = texas:TPS7A30
U$22 = rj:6P6C_TOP
U$39 = texas:LMP2021
U$40 = texas:ADS1018
U$42 = dc-dc-converter:TSRN1
U$44 U$52 = SparkFun-Resistors:0.05OHM-1/5W-1%(0603); PROD_ID: RES-12535
U$60 U$61 = SparkFun-Passives:INDUCTOR: Inductors Basic Inductor/Choke - 0603 and 1206. Footprints are not proven and vary greatly between part numbers. INDUCTOR POWER 3.3UH 4.0A SMD 0.197" L x 0.197" W x 0.177" H (5.00mm x 5.00mm x 4.50mm)
X5 X8 = con-phoenix-500:MSTBV8: PHOENIX; OC_FARNELL: unknown; OC_NEWARK: unknown